# EAGLE board DeMux3 (EAGLE 6.6.0), part 1 of 2
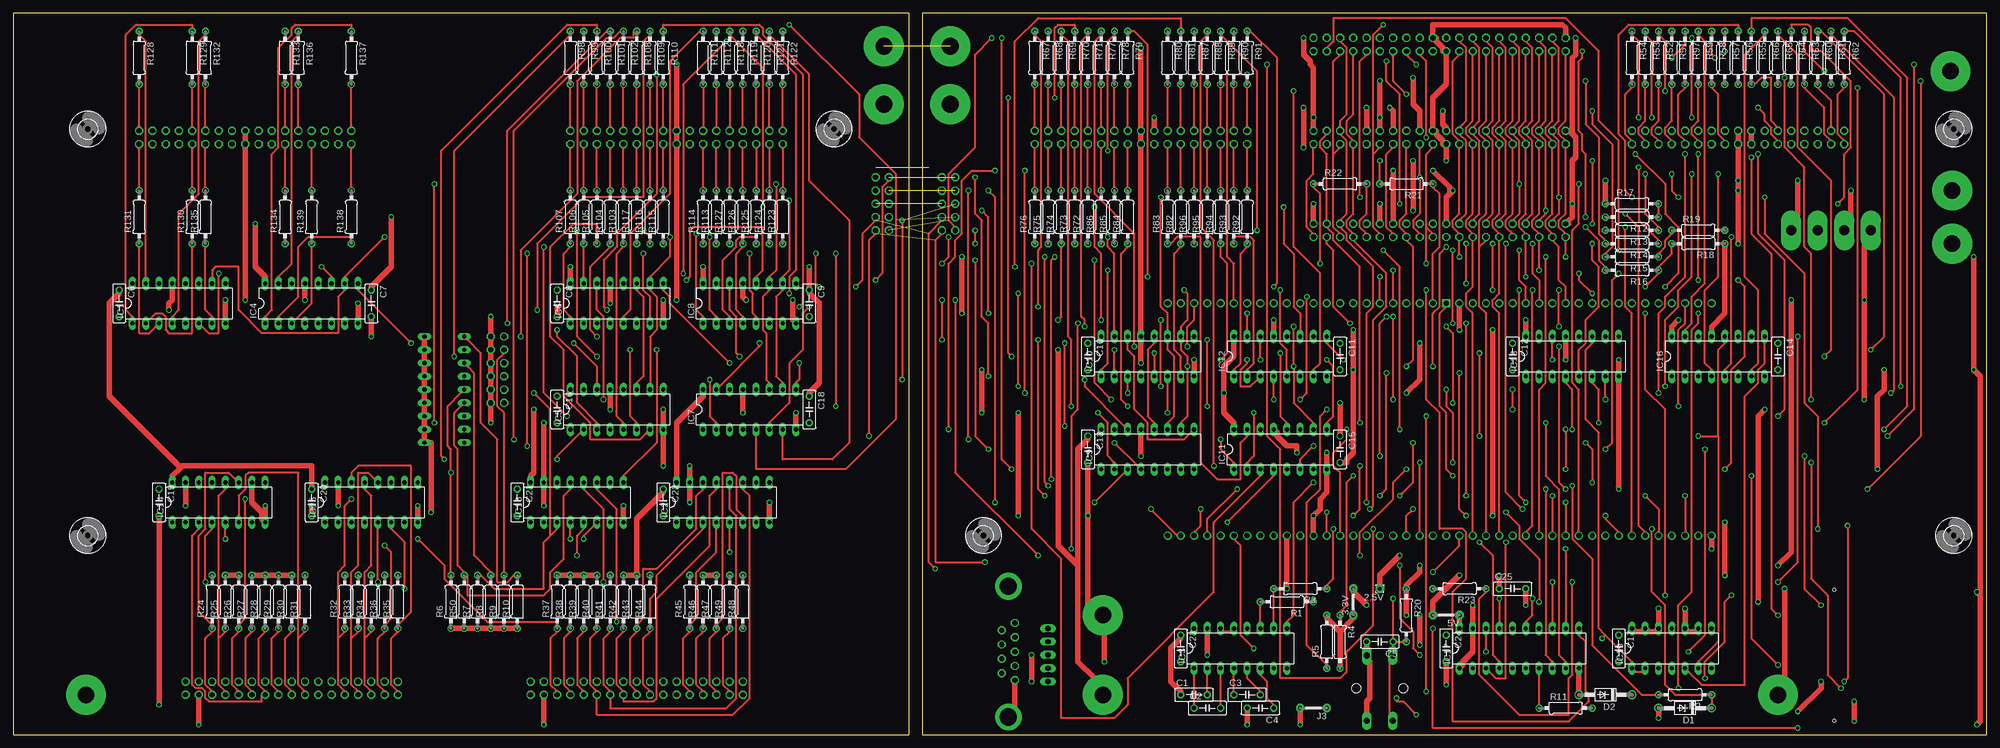
[diagram p3: board, top side]
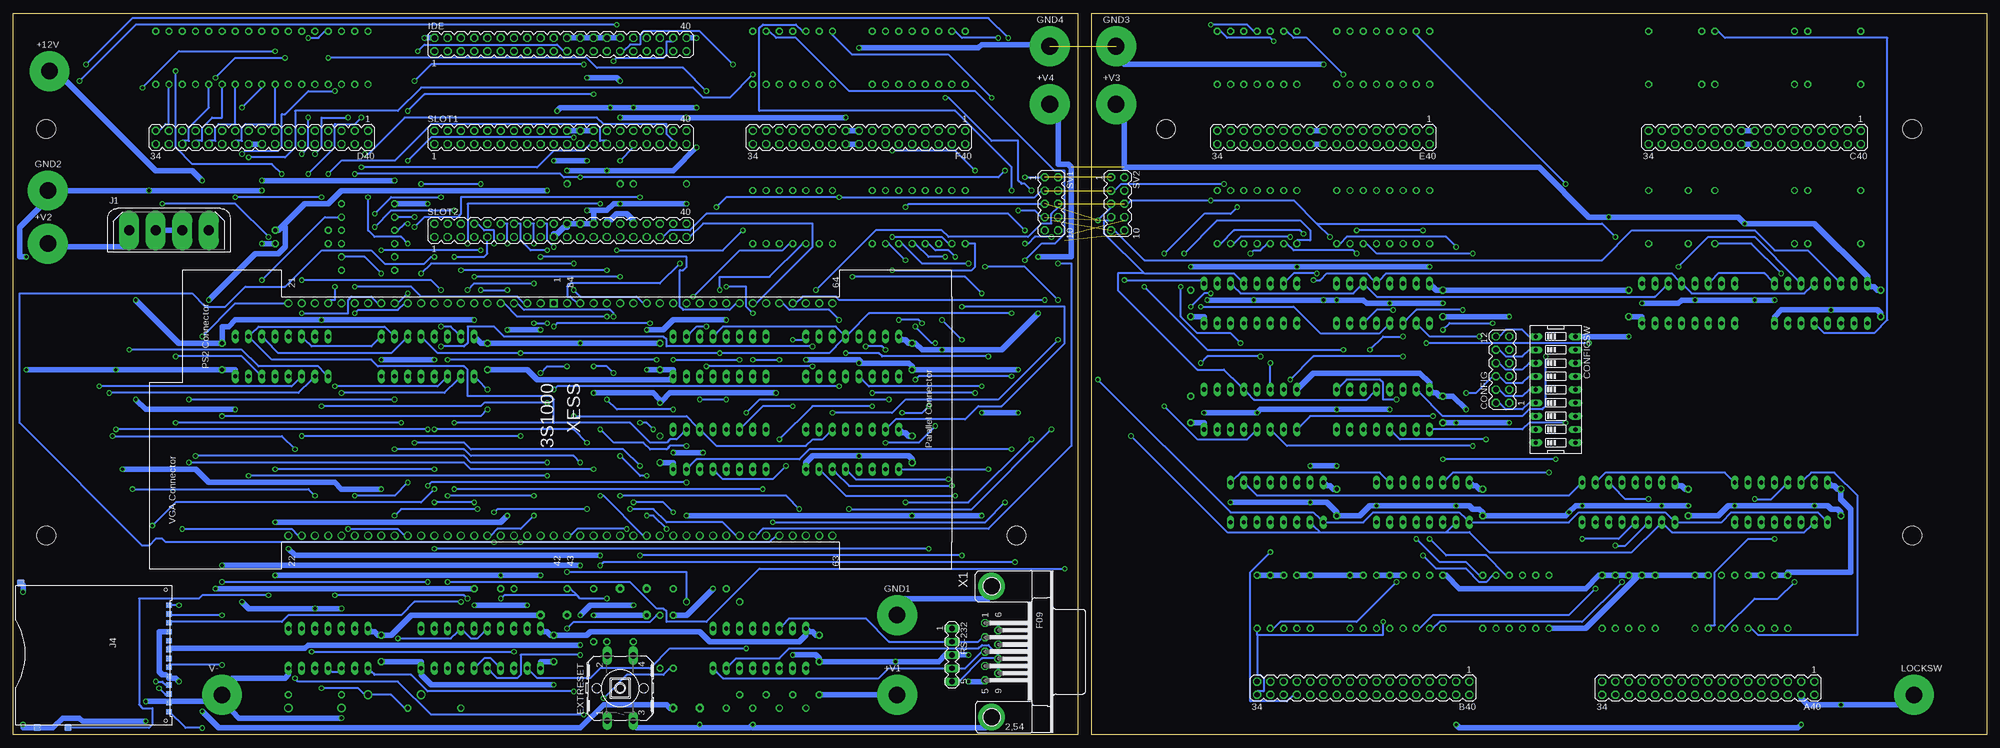
[diagram p4: board, bottom side, seen from below]

Size 377.82 x 138.11 mm. Coordinates in mm from the lower left corner, seen from the top.
Outline: 377.82,138.11 377.82,0 173.99,0 173.99,138.11
Outline: 377.82,138.11 173.99,138.11
Outline: 377.82,138.11 173.99,138.11
Outline: 171.45,138.11 0,138.11 0,0 171.45,0 171.45,138.11
Copper layers (1*16): Top 0.035mm / dielectric 1.5mm / Bottom 0.035mm
Design rules "15mils": minimum track width 15mil, minimum drill 24mil, track to track 15mil, track to pad 10mil, pad to pad 10mil, via to via 10mil, smd to smd 10mil, copper to edge 25mil, drill to drill 10mil, minimum pad ring 10mil, minimum via ring 8mil, stop-mask expansion 0mil, vias tented up to drill 0mil, thermal gap 10mil
Net classes: 1 supply: width 1.016 mm

## Footprints (pad centres in the part's own frame; a part is rotated, then mirrored left to right if it is on the bottom)
1,6/0,8 = drill 0.813 pad 1.6 octagon: 1 0,0
05 = drill 0.813 pad 1.6 octagon: 1 -2.54,0; 2 2.54,0
SPADELUG = drill 3.175 pad 7.62: 1 0,0
MA17-2 = drill 1.016 octagon: 1 -20.32,-1.27; 2 -20.32,1.27; 3 -17.78,-1.27; 4 -17.78,1.27; 5 -15.24,-1.27; 6 -15.24,1.27; 7 -12.7,-1.27; 8 -12.7,1.27; 9 -10.16,-1.27; 10 -10.16,1.27; 11 -7.62,-1.27; 12 -7.62,1.27; 13 -5.08,-1.27; 14 -5.08,1.27; 15 -2.54,-1.27; 16 -2.54,1.27; 17 0,-1.27; 18 0,1.27; 19 2.54,-1.27; 20 2.54,1.27; 21 5.08,-1.27; 22 5.08,1.27; 23 7.62,-1.27; 24 7.62,1.27; 25 10.16,-1.27; 26 10.16,1.27; 27 12.7,-1.27; 28 12.7,1.27; 29 15.24,-1.27; 30 15.24,1.27; 31 17.78,-1.27; 32 17.78,1.27; 33 20.32,-1.27; 34 20.32,1.27
C050-025X075 = drill 0.813 octagon: 1 -2.54,0; 2 2.54,0
MA06-2 = drill 1.016 octagon: 1 -6.35,-1.27; 2 -6.35,1.27; 3 -3.81,-1.27; 4 -3.81,1.27; 5 -1.27,-1.27; 6 -1.27,1.27; 7 1.27,-1.27; 8 1.27,1.27; 9 3.81,-1.27; 10 3.81,1.27; 11 6.35,-1.27; 12 6.35,1.27
EDG-09 = drill 0.813 long: 1 -10.16,-3.81; 2 -7.62,-3.81; 3 -5.08,-3.81; 4 -2.54,-3.81; 5 0,-3.81; 6 2.54,-3.81; 7 5.08,-3.81; 8 7.62,-3.81; 9 10.16,-3.81; 10 10.16,3.81; 11 7.62,3.81; 12 5.08,3.81; 13 2.54,3.81; 14 0,3.81; 15 -2.54,3.81; 16 -5.08,3.81; 17 -7.62,3.81; 18 -10.16,3.81
DO41Z10 = drill 1.118: A 5.08,0; C -5.08,0
B3F-40XX = drill 1.194 long: 1 -6.248,2.489; 2 6.248,2.489; 3 -6.248,-2.489; 4 6.248,-2.489 | hole 1.803: 0,-4.496; 0,4.496
DIL16 = drill 0.813 long: 1 -8.89,-3.81; 2 -6.35,-3.81; 3 -3.81,-3.81; 4 -1.27,-3.81; 5 1.27,-3.81; 6 3.81,-3.81; 7 6.35,-3.81; 8 8.89,-3.81; 9 8.89,3.81; 10 6.35,3.81; 11 3.81,3.81; 12 1.27,3.81; 13 -1.27,3.81; 14 -3.81,3.81; 15 -6.35,3.81; 16 -8.89,3.81
DIL20 = drill 0.813 long: 1 -11.43,-3.81; 2 -8.89,-3.81; 3 -6.35,-3.81; 4 -3.81,-3.81; 5 -1.27,-3.81; 6 1.27,-3.81; 7 3.81,-3.81; 8 6.35,-3.81; 9 8.89,-3.81; 10 11.43,-3.81; 11 11.43,3.81; 12 8.89,3.81; 13 6.35,3.81; 14 3.81,3.81; 15 1.27,3.81; 16 -1.27,3.81; 17 -3.81,3.81; 18 -6.35,3.81; 19 -8.89,3.81; 20 -11.43,3.81
DIL14 = drill 0.813 long: 1 -7.62,-3.81; 2 -5.08,-3.81; 3 -2.54,-3.81; 4 0,-3.81; 5 2.54,-3.81; 6 5.08,-3.81; 7 7.62,-3.81; 8 7.62,3.81; 9 5.08,3.81; 10 2.54,3.81; 11 0,3.81; 12 -2.54,3.81; 13 -5.08,3.81; 14 -7.62,3.81
MA20-2 = drill 1.016 octagon: 1 -24.13,-1.27; 2 -24.13,1.27; 3 -21.59,-1.27; 4 -21.59,1.27; 5 -19.05,-1.27; 6 -19.05,1.27; 7 -16.51,-1.27; 8 -16.51,1.27; 9 -13.97,-1.27; 10 -13.97,1.27; 11 -11.43,-1.27; 12 -11.43,1.27; 13 -8.89,-1.27; 14 -8.89,1.27; 15 -6.35,-1.27; 16 -6.35,1.27; 17 -3.81,-1.27; 18 -3.81,1.27; 19 -1.27,-1.27; 20 -1.27,1.27; 21 1.27,-1.27; 22 1.27,1.27; 23 3.81,-1.27; 24 3.81,1.27; 25 6.35,-1.27; 26 6.35,1.27; 27 8.89,-1.27; 28 8.89,1.27; 29 11.43,-1.27; 30 11.43,1.27; 31 13.97,-1.27; 32 13.97,1.27; 33 16.51,-1.27; 34 16.51,1.27; 35 19.05,-1.27; 36 19.05,1.27; 37 21.59,-1.27; 38 21.59,1.27; 39 24.13,-1.27; 40 24.13,1.27
FLOPPY-4 = drill 1.93 pad 3.81 long: 1 7.62,0; 2 2.54,0; 3 -2.54,0; 4 -7.62,0
SCDA5A = smd 1 x 1.3: 1 -7.525,-0.65; 2 -5.825,-0.65; 3 -4.125,-0.65; 3A -2.425,-0.65; 4 -0.725,-0.65; 4A 0.975,-0.65; 5 2.675,-0.65; 6 4.375,-0.65; 7 6.075,-0.65; 8 7.775,-0.65; 9 -9.225,-0.65; 10 11.175,-0.65; 11 9.475,-0.65 | smd 1.4 x 1.4: 12 14.2,-19.955; 13 14.2,-25.875; 14 -13.475,-28.975 | hole 0.61: 12.875,-1.235; -12.125,-1.235
0207/10 = drill 0.813 octagon: 1 -5.08,0; 2 5.08,0
MA05-1 = drill 1.016 long: 1 -5.08,0; 2 -2.54,0; 3 0,0; 4 2.54,0; 5 5.08,0
MA05-2 = drill 1.016 octagon: 1 -5.08,-1.27; 2 -5.08,1.27; 3 -2.54,-1.27; 4 -2.54,1.27; 5 0,-1.27; 6 0,1.27; 7 2.54,-1.27; 8 2.54,1.27; 9 5.08,-1.27; 10 5.08,1.27
3,6 = hole 3.6: 0,0
F09HP = drill 1.016 octagon: 1 -5.486,-1.27; 2 -2.743,-1.27; 3 0,-1.27; 4 2.743,-1.27; 5 5.486,-1.27; 6 -4.115,1.27; 7 -1.372,1.27; 8 1.372,1.27; 9 4.115,1.27 | drill 3.302 pad 5.08: G1 -12.522,0; G2 12.522,0
3S1000 = drill 1.016 square: 1 0,0 | drill 1.016: 2 0,-2.54; 3 0,-5.08; 4 0,-7.62; 5 0,-10.16; 6 0,-12.7; 7 0,-15.24; 8 0,-17.78; 9 0,-20.32; 10 0,-22.86; 11 0,-25.4; 12 0,-27.94; 13 0,-30.48; 14 0,-33.02; 15 0,-35.56; 16 0,-38.1; 17 0,-40.64; 18 0,-43.18; 19 0,-45.72; 20 0,-48.26; 21 0,-50.8; 22 44.45,-50.8; 23 44.45,-48.26; 24 44.45,-45.72; 25 44.45,-43.18; 26 44.45,-40.64; 27 44.45,-38.1; 28 44.45,-35.56; 29 44.45,-33.02; 30 44.45,-30.48; 31 44.45,-27.94; 32 44.45,-25.4; 33 44.45,-22.86; 34 44.45,-20.32; 35 44.45,-17.78; 36 44.45,-15.24; 37 44.45,-12.7; 38 44.45,-10.16; 39 44.45,-7.62; 40 44.45,-5.08; 41 44.45,-2.54; 42 44.45,0; 43 44.45,2.54; 44 44.45,5.08; 45 44.45,7.62; 46 44.45,10.16; 47 44.45,12.7; 48 44.45,15.24; 49 44.45,17.78; 50 44.45,20.32; 51 44.45,22.86; 52 44.45,25.4; 53 44.45,27.94; 54 44.45,30.48; 55 44.45,33.02; 56 44.45,35.56; 57 44.45,38.1; 58 44.45,40.64; 59 44.45,43.18; 60 44.45,45.72; 61 44.45,48.26; 62 44.45,50.8; 63 44.45,53.34; 64 0,53.34; 65 0,50.8; 66 0,48.26; 67 0,45.72; 68 0,43.18; 69 0,40.64; 70 0,38.1; 71 0,35.56; 72 0,33.02; 73 0,30.48; 74 0,27.94; 75 0,25.4; 76 0,22.86; 77 0,20.32; 78 0,17.78; 79 0,15.24; 80 0,12.7; 81 0,10.16; 82 0,7.62; 83 0,5.08; 84 0,2.54

## Placement (x,y rotation side)
2.5V  [1,6/0,8]  261.62,27.94 180 top
3.3V  J5MM  [05]  256.54,25.4 90 top
5V  J5MM  [05]  274.32,22.86 180 top
+12V  LUG  [SPADELUG]  370.84,127 0 bottom
+V1  LUG  [SPADELUG]  208.6,7.62 0 bottom
+V2  LUG  [SPADELUG]  371.16,93.98 0 bottom
+V3  LUG  [SPADELUG]  166.69,120.65 0 bottom
+V4  LUG  [SPADELUG]  179.39,120.65 0 bottom
A40  [MA17-2]  53.34,8.89 180 bottom
B40  [MA17-2]  119.38,8.89 180 bottom
C1  0.1uf  [C050-025X075]  226.06,7.62 0 top
C2  0.1uf  [C050-025X075]  228.6,5.08 0 top
C3  0.1uf  [C050-025X075]  236.22,7.62 0 top
C4  0.1uf  [C050-025X075]  238.76,5.08 180 top
C5  0.1uf  [C050-025X075]  261.62,17.78 180 top
C6  0.1uf  [C050-025X075]  20.32,82.55 270 top
C7  0.1uf  [C050-025X075]  68.58,82.55 270 top
C8  0.1uf  [C050-025X075]  104.14,82.55 270 top
C9  0.1uf  [C050-025X075]  152.4,82.55 270 top
C10  0.1uf  [C050-025X075]  205.74,72.39 270 top
C11  0.1uf  [C050-025X075]  254,72.39 270 top
C12  0.1uf  [C050-025X075]  287.02,72.39 270 top
C13  0.1uf  [C050-025X075]  205.74,54.61 270 top
C14  0.1uf  [C050-025X075]  337.82,72.39 270 top
C15  0.1uf  [C050-025X075]  254,54.61 270 top
C16  0.1uf  [C050-025X075]  104.14,62.23 270 top
C17  0.1uf  [C050-025X075]  307.34,16.51 270 top
C18  0.1uf  [C050-025X075]  152.4,62.23 270 top
C19  0.1uf  [C050-025X075]  27.94,44.45 270 top
C20  0.1uf  [C050-025X075]  57.15,44.45 270 top
C21  0.1uf  [C050-025X075]  96.52,44.45 270 top
C22  0.1uf  [C050-025X075]  124.46,44.45 270 top
C23  0.1uf  [C050-025X075]  223.52,16.51 270 top
C24  0.1uf  [C050-025X075]  274.32,16.51 270 top
C25  0.1uf  [C050-025X075]  287.02,27.94 0 top
C40  [MA17-2]  44.45,114.3 180 bottom
CONFIG  [MA06-2]  92.71,69.85 90 bottom
CONFIGSW  [EDG-09]  82.55,66.04 270 bottom
D1  1N4728  [DO41Z10]  320.04,5.08 180 top
D2  1N4728  [DO41Z10]  304.8,7.62 180 top
D40  [MA17-2]  330.2,114.3 180 bottom
E40  [MA17-2]  127,114.3 180 bottom
EXTRESET  [B3F-40XX]  261.62,8.89 90 bottom
F40  [MA17-2]  215.9,114.3 180 bottom
GND1  LUG  [SPADELUG]  208.6,22.86 0 bottom
GND2  LUG  [SPADELUG]  371.16,104.14 0 bottom
GND3  LUG  [SPADELUG]  166.69,131.76 0 bottom
GND4  LUG  [SPADELUG]  179.39,131.76 0 bottom
IC1  74HC595N  [DIL16]  31.75,82.55 0 top
IC2  74HC165N  [DIL16]  135.89,44.45 0 top
IC3  MAX232A  [DIL16]  234.95,16.51 0 top
IC4  74HC595N  [DIL16]  57.15,82.55 0 top
IC5  74HC595N  [DIL16]  115.57,62.23 0 top
IC6  74HC595N  [DIL16]  115.57,82.55 0 top
IC7  74HC595N  [DIL16]  140.97,62.23 0 top
IC8  74HC595N  [DIL16]  140.97,82.55 0 top
IC9  74HC595N  [DIL16]  217.17,54.61 0 top
IC10  74HC595N  [DIL16]  217.17,72.39 0 top
IC11  74HC595N  [DIL16]  242.57,54.61 0 top
IC12  74HC595N  [DIL16]  242.57,72.39 0 top
IC13  74HC595N  [DIL16]  298.45,72.39 0 top
IC14  74HC165N  [DIL16]  39.37,44.45 0 top
IC15  74HC165N  [DIL16]  68.58,44.45 0 top
IC16  74HC595N  [DIL16]  326.39,72.39 0 top
IC17  74LS244N  [DIL20]  288.29,16.51 0 top
IC18  74HC165N  [DIL16]  107.95,44.45 0 top
IC19  74ALS00N  [DIL14]  317.5,16.51 0 top
IDE  [MA20-2]  273.05,132.08 0 bottom
J1  [FLOPPY-4]  347.98,96.52 0 bottom
J3  J5MM  [05]  248.92,5.08 180 top
J4  SDCARD  [SCDA5A]  347.35,15.56 270 bottom
LOCKSW  LUG  [SPADELUG]  13.97,7.62 0 bottom
R1  330  [0207/10]  243.84,25.4 180 top
R2  330  [0207/10]  320.04,7.62 180 top
R3  330  [0207/10]  246.38,27.94 180 top
R4  330  [0207/10]  254,17.78 270 top
R5  330  [0207/10]  251.46,17.78 90 top
R6  3K  [0207/10]  83.82,25.4 90 top
R7  3K  [0207/10]  88.9,25.4 90 top
R8  3K  [0207/10]  91.44,25.4 90 top
R9  3K  [0207/10]  93.98,25.4 90 top
R10  3K  [0207/10]  96.52,25.4 90 top
R11  330  [0207/10]  297.18,5.08 0 top
R12  330  [0207/10]  309.88,99.06 180 top
R13  47  [0207/10]  309.88,96.52 180 top
R14  47  [0207/10]  309.88,93.98 180 top
R15  330  [0207/10]  309.88,91.44 180 top
R16  330  [0207/10]  309.88,88.9 180 top
R17  10K  [0207/10]  309.88,101.6 0 top
R18  10K  [0207/10]  322.58,93.98 180 top
R19  10K  [0207/10]  322.58,96.52 0 top
R20  4.7K  [0207/10]  266.7,22.86 270 top
R21  330  [0207/10]  266.7,105.41 180 top
R22  330  [0207/10]  254,105.41 0 top
R23  330  [0207/10]  276.86,27.94 180 top
R24  3K  [0207/10]  38.1,25.4 90 top
R25  3K  [0207/10]  40.64,25.4 90 top
R26  3K  [0207/10]  43.18,25.4 90 top
R27  3K  [0207/10]  45.72,25.4 90 top
R28  3K  [0207/10]  48.26,25.4 90 top
R29  3K  [0207/10]  50.8,25.4 90 top
R30  3K  [0207/10]  53.34,25.4 90 top
R31  3K  [0207/10]  55.88,25.4 90 top
R32  3K  [0207/10]  63.5,25.4 90 top
R33  3K  [0207/10]  66.04,25.4 90 top
R34  3K  [0207/10]  68.58,25.4 90 top
R35  3K  [0207/10]  73.66,25.4 90 top
R36  3K  [0207/10]  71.12,25.4 90 top
R37  3K  [0207/10]  104.14,25.4 90 top
R38  3K  [0207/10]  106.68,25.4 90 top
R39  3K  [0207/10]  109.22,25.4 90 top
R40  3K  [0207/10]  111.76,25.4 90 top
R41  3K  [0207/10]  114.3,25.4 90 top
R42  3K  [0207/10]  116.84,25.4 90 top
R43  3K  [0207/10]  119.38,25.4 90 top
R44  3K  [0207/10]  121.92,25.4 90 top
R45  3K  [0207/10]  129.54,25.4 90 top
R46  3K  [0207/10]  132.08,25.4 90 top
R47  3K  [0207/10]  134.62,25.4 90 top
R48  3K  [0207/10]  139.7,25.4 90 top
R49  3K  [0207/10]  137.16,25.4 90 top
R50  3K  [0207/10]  86.36,25.4 90 top
R51  [0207/10]  317.5,129.54 270 top
R52  [0207/10]  314.96,129.54 270 top
R53  [0207/10]  312.42,129.54 270 top
R54  [0207/10]  309.88,129.54 270 top
R55  [0207/10]  332.74,129.54 270 top
R56  [0207/10]  330.2,129.54 270 top
R57  [0207/10]  327.66,129.54 270 top
R58  3K  [0207/10]  325.12,129.54 270 top
R59  [0207/10]  322.58,129.54 270 top
R60  [0207/10]  345.44,129.54 270 top
R61  [0207/10]  347.98,129.54 270 top
R62  [0207/10]  350.52,129.54 270 top
R63  [0207/10]  342.9,129.54 270 top
R64  [0207/10]  340.36,129.54 270 top
R65  [0207/10]  337.82,129.54 270 top
R66  3K  [0207/10]  335.28,129.54 270 top
R67  [0207/10]  195.58,129.54 270 top
R68  [0207/10]  198.12,129.54 270 top
R69  [0207/10]  200.66,129.54 270 top
R70  [0207/10]  203.2,129.54 270 top
R71  [0207/10]  205.74,129.54 270 top
R72  [0207/10]  205.74,99.06 90 top
R73  [0207/10]  203.2,99.06 90 top
R74  3K  [0207/10]  200.66,99.06 90 top
R75  [0207/10]  198.12,99.06 90 top
R76  [0207/10]  195.58,99.06 90 top
R77  [0207/10]  208.28,129.54 270 top
R78  [0207/10]  210.82,129.54 270 top
R79  [0207/10]  213.36,129.54 270 top
R80  [0207/10]  220.98,129.54 270 top
R81  [0207/10]  223.52,129.54 270 top
R82  3K  [0207/10]  223.52,99.06 90 top
R83  [0207/10]  220.98,99.06 90 top
R84  [0207/10]  213.36,99.06 90 top
R85  [0207/10]  210.82,99.06 90 top
R86  [0207/10]  208.28,99.06 90 top
R87  [0207/10]  226.06,129.54 270 top
R88  [0207/10]  228.6,129.54 270 top
R89  [0207/10]  231.14,129.54 270 top
R90  3K  [0207/10]  233.68,129.54 270 top
R91  [0207/10]  236.22,129.54 270 top
R92  [0207/10]  236.22,99.06 90 top
R93  [0207/10]  233.68,99.06 90 top
R94  [0207/10]  231.14,99.06 90 top
R95  [0207/10]  228.6,99.06 90 top
R96  [0207/10]  226.06,99.06 90 top
R97  3K  [0207/10]  320.04,129.54 270 top
R98  [0207/10]  106.68,129.54 270 top
R99  [0207/10]  109.22,129.54 270 top
R100  [0207/10]  111.76,129.54 270 top
R101  [0207/10]  114.3,129.54 270 top
R102  [0207/10]  116.84,129.54 270 top
R103  [0207/10]  116.84,99.06 90 top
R104  [0207/10]  114.3,99.06 90 top
R105  3K  [0207/10]  111.76,99.06 90 top
R106  [0207/10]  109.22,99.06 90 top
R107  [0207/10]  106.68,99.06 90 top
R108  [0207/10]  119.38,129.54 270 top
R109  [0207/10]  121.92,129.54 270 top
R110  [0207/10]  124.46,129.54 270 top
R111  [0207/10]  132.08,129.54 270 top
R112  [0207/10]  134.62,129.54 270 top
R113  3K  [0207/10]  134.62,99.06 90 top
R114  [0207/10]  132.08,99.06 90 top
R115  [0207/10]  124.46,99.06 90 top
R116  [0207/10]  121.92,99.06 90 top
R117  [0207/10]  119.38,99.06 90 top
R118  [0207/10]  137.16,129.54 270 top
R119  [0207/10]  139.7,129.54 270 top
R120  [0207/10]  142.24,129.54 270 top
R121  3K  [0207/10]  144.78,129.54 270 top
R122  [0207/10]  147.32,129.54 270 top
R123  [0207/10]  147.32,99.06 90 top
R124  [0207/10]  144.78,99.06 90 top
R125  [0207/10]  142.24,99.06 90 top
R126  [0207/10]  139.7,99.06 90 top
R127  3K  [0207/10]  137.16,99.06 90 top
R128  [0207/10]  24.13,129.54 270 top
R129  [0207/10]  34.29,129.54 270 top
R130  [0207/10]  34.29,99.06 90 top
R131  [0207/10]  24.13,99.06 90 top
R132  [0207/10]  36.83,129.54 270 top
R133  [0207/10]  52.07,129.54 270 top
R134  [0207/10]  52.07,99.06 90 top
R135  3K  [0207/10]  36.83,99.06 90 top
R136  [0207/10]  54.61,129.54 270 top
R137  [0207/10]  64.77,129.54 270 top
R138  [0207/10]  64.77,99.06 90 top
R139  3K  [0207/10]  57.15,99.06 90 top
RS-232  [MA05-1]  198.12,15.24 270 bottom
SLOT1  [MA20-2]  273.05,114.3 0 bottom
SLOT2  [MA20-2]  273.05,96.52 0 bottom
SV1  [MA05-2]  179.07,101.6 270 bottom
SV2  [MA05-2]  166.37,101.6 270 bottom
U$5  [3,6]  371.48,115.89 0 top
U$6  [3,6]  371.48,38.1 0 top
U$7  [3,6]  185.74,38.1 0 top
U$8  [3,6]  14.29,38.1 0 top
U$9  [3,6]  14.29,115.89 0 top
U$11  [3,6]  157.16,115.89 0 top
V-  LUG  [SPADELUG]  337.82,7.62 0 bottom
X1  [F09HP]  190.5,15.88 270 bottom
XESS  3S1000  [3S1000]  274.32,82.55 270 bottom

## Tracks (layer width: path | path; a pad name or v marks a point on that pad's centre or on a via)
3S-LCLK  (via drill 0.61)
  Top 0.381: v280.67,36.83 283.21,34.29 283.21,15.24 284.48,13.97 IC17.4
  Bottom 0.381: IC17.4 285.12,13.34 286.38,14.61 287.65,14.61 288.93,13.34 IC17.6 | v280.67,36.83 233.04,36.83 231.78,38.1 XESS.59
3S-LSER  (via drill 0.61)
  Top 0.381: v237.49,16.51 234.95,19.05 234.95,36.2 233.68,37.47 XESS.58
  Bottom 0.381: v237.49,16.51 252.09,16.51 255.91,12.7 265.43,12.7 267.33,10.79 277.5,10.79 278.76,12.06 IC17.2
3S-SCLK  (via drill 0.61)
  Top 0.381: v290.83,26.04 290.83,22.86 289.56,21.59 IC17.15 | v316.23,26.67 316.23,62.23 312.42,66.04 v312.42,80.64
  Bottom 0.381: v290.83,26.04 291.46,26.67 v316.23,26.67 | v312.42,80.64 311.79,81.28 304.17,81.28 302.89,82.55 XESS.12
3S-SSER  (via drill 0.61)
  Top 0.381: v322.58,80.64 322.58,78.74 321.31,77.47 321.31,27.3 318.77,24.77 v318.77,8.89
  Bottom 0.381: R11.2 302.89,5.08 305.44,7.62 309.25,7.62 D2.C 310.51,7.62 311.79,8.89 v318.77,8.89 | v322.58,80.64 313.69,80.64 313.69,83.19 313.06,83.82 309.25,83.82 307.98,82.55 XESS.14
!3S-LCL  (via drill 0.61)
  Top 0.381: v270.51,85.09 270.51,64.14 273.05,61.59 273.05,39.37 277.5,39.37 278.13,38.73 278.13,29.84 275.59,27.3 275.59,2.54 297.81,2.54 301.62,6.35 301.62,7.62 300.99,8.26 300.99,17.78 299.72,19.05 IC17.11
  Bottom 0.381: v270.51,85.09 269.24,83.82 258.44,83.82 257.18,82.55 XESS.78
!3S-SCL  (via drill 0.61)
  Top 0.381: v293.37,46.99 293.37,15.24 294.64,13.97 IC17.8 | v234.31,46.99 228.6,41.27 228.6,38.73 XESS.60
  Bottom 0.381: v234.31,46.99 v293.37,46.99
!LCL  (via drill 0.61)  (1 unrouted)
  Top 0.381: IC9.10 223.52,59.69 224.79,60.96 v224.79,70.48 224.79,72.39 223.52,73.66 223.52,74.93 IC10.10 223.52,77.47 223.52,78.11 224.79,79.38 224.79,84.45 v224.16,85.09 | v245.11,78.11 v245.11,70.48 245.11,63.5 248.92,59.69 IC11.10 | v293.37,59.69 293.37,49.53 295.91,46.99 295.91,15.24 297.18,13.97 IC17.9 | IC1.10 38.1,87.63 38.1,88.9 38.73,89.53 43.18,89.53 43.18,81.28 47.62,76.83 62.23,76.83 62.23,83.82 63.5,85.09 IC4.10 63.5,87.63 v71.12,95.25 | IC5.10 121.92,67.31 121.92,76.2 123.19,77.47 123.19,83.82 121.92,85.09 IC6.10 121.92,87.63 125.73,91.44 v125.73,95.25 | IC7.10 147.32,67.31 146.05,68.58 146.05,83.82 147.32,85.09 IC8.10 147.32,87.63 148.59,88.9 v148.59,102.23
  Bottom 0.381: v224.16,85.09 212.72,96.52 200.03,96.52 198.75,95.25 183.51,95.25 180.97,97.79 179.07,97.79 179.07,99.69 177.8,100.97 SV1.6 | IC13.10 305.44,76.83 306.7,78.11 330.83,78.11 332.11,76.83 IC16.10 332.11,75.56 328.3,71.75 309.25,71.75 307.98,70.48 291.46,70.48 290.83,69.85 290.83,64.77 274.95,64.77 274.32,64.14 274.32,59.69 | v245.11,78.11 247.01,78.11 248.28,76.83 IC12.10 | 274.32,59.69 259.71,59.69 255.91,55.88 252.73,55.88 252.09,56.52 250.82,56.52 249.56,57.78 IC11.10 | 274.32,59.69 v293.37,59.69 | v224.79,70.48 v245.11,70.48 | SV2.6 164.47,101.6 163.83,102.23 v148.59,102.23 132.72,102.23 128.27,97.79 | 128.27,97.79 v125.73,95.25 | v71.12,95.25 73.66,97.79 128.27,97.79
!SCL  (via drill 0.61)  (1 unrouted)
  Top 0.381: v297.18,35.56 297.18,21.59 IC17.12 | v202.56,35.56 202.56,60.96 203.84,62.23 v203.84,78.74 | v208.28,79.38 208.28,92.08 207.01,93.34 v207.01,100.97 | v170.18,98.42 v170.18,67.94
  Bottom 0.381: v202.56,35.56 v297.18,35.56 | v203.84,78.74 204.47,79.38 v208.28,79.38 | v207.01,100.97 206.38,101.6 180.97,101.6 SV1.5 | IC14.1 31.11,41.27 32.38,42.55 48.9,42.55 50.8,40.64 59.05,40.64 IC15.1 60.33,41.27 61.59,42.55 78.11,42.55 80.01,40.64 98.42,40.64 IC18.1 99.69,41.27 100.97,42.55 117.47,42.55 119.38,40.64 126.36,40.64 IC2.1 127.64,41.27 128.91,42.55 144.78,42.55 v170.18,67.94 | v170.18,98.42 167.64,100.97 SV2.5
!SSER  (via drill 0.61)  (1 unrouted)
  Top 0.381: v294.64,29.21 294.64,21.59 IC17.13 | v176.53,31.75 175.26,33.02 175.26,95.89 177.8,98.42 SV1.8 | v123.19,73.66 123.19,55.88 116.84,49.53 IC18.9 | v161.29,85.72 162.56,87 162.56,95.89 165.1,98.42 SV2.8
  Bottom 0.381: v294.64,29.21 259.71,29.21 254.63,24.13 253.37,24.13 252.73,23.5 252.73,21.59 245.11,21.59 234.95,31.75 v176.53,31.75 | v123.19,73.66 149.22,73.66 v161.29,85.72
+2V5  (via drill 0.61)
  Top 1.016: v325.12,35.56 325.12,37.47 XESS.22 | v265.43,34.29 261.62,30.48 261.62,28.57 2.5V.1
  Bottom 1.016: v325.12,35.56 323.85,34.29 v265.43,34.29
+3V3  (via drill 0.61)
  Top 1.016: v266.7,22.86 266.7,27.3 R20.1 266.7,28.57 269.24,31.11 v269.24,32.38 | 254,19.68 251.46,22.23 R5.2 | 254,19.68 254,13.34 R4.2 | v243.84,27.94 243.84,37.47 XESS.54 | 254,19.68 256.54,22.23 3.3V.1 | v259.08,120.02 259.08,116.2 SLOT1.32 | v263.52,120.02 264.16,119.38 264.16,116.2 SLOT1.28 | v273.69,119.38 273.69,116.84 274.32,116.2 SLOT1.20 | 275.27,103.82 274.32,102.87 274.32,98.42 SLOT2.20 | v275.59,104.14 275.27,103.82 | v264.16,107.95 264.16,98.42 SLOT2.28 | v271.78,107.95 274.95,104.78 274.95,104.14 275.27,103.82 | v247.01,112.39 v247.01,120.02 | v337.82,32.38 340.36,34.92 v340.36,83.19
  Bottom 1.016: v266.7,22.86 257.18,22.86 3.3V.1 | v243.84,27.94 248.92,22.86 250.82,22.86 R5.2 | v273.69,119.38 273.05,120.02 v263.52,120.02 v259.08,120.02 v247.01,120.02 | SLOT2.32 259.08,98.42 260.35,99.69 262.25,99.69 263.52,98.42 264.16,98.42 SLOT2.28 | 326.07,97.47 321.94,101.6 317.5,101.6 314.96,104.14 v275.59,104.14 | 326.07,97.47 327.02,96.52 R19.2 | v271.78,107.95 v264.16,107.95 251.46,107.95 v247.01,112.39 | v269.24,32.38 v337.82,32.38 | v340.36,83.19 331.47,92.08 327.02,92.08 325.75,93.34 325.75,97.16 326.07,97.47
+5V  (via drill 0.61)
  Top 1.016: v284.48,30.48 284.48,28.57 C25.1 | v276.86,30.48 271.78,25.4 271.78,23.5 5V.2 | v276.86,77.47 276.86,81.92 XESS.2 | v283.21,41.91 v283.21,77.47 | v327.66,30.48 v327.66,40.64
  Bottom 1.016: v276.86,30.48 v284.48,30.48 v327.66,30.48 | v283.21,77.47 v276.86,77.47 | v283.21,41.91 284.48,40.64 v327.66,40.64
+12V  (via drill 0.61)
  Top 1.016: v341.63,106.05 341.63,99.69 J1.1
  Bottom 1.016: v341.63,106.05 343.54,107.95 350.52,107.95 367.67,125.09 +12V.1
AC0
  Top 0.381: R101.2 114.3,123.83 114.3,116.2 E40.7
AC1
  Top 0.381: R106.2 109.22,104.78 109.22,112.39 E40.4
AC2
  Top 0.381: R111.2 132.08,123.83 132.08,116.2 E40.21
AC3
  Top 0.381: R116.2 121.92,104.78 121.92,112.39 E40.14
AC4
  Top 0.381: R121.2 144.78,123.83 144.78,116.2 E40.31
AC5
  Top 0.381: R126.2 139.7,104.78 139.7,112.39 E40.28
AC6
  Top 0.381: R70.2 203.2,123.83 203.2,116.2 F40.7
AC7
  Top 0.381: R75.2 198.12,104.78 198.12,112.39 F40.4
AC8
  Top 0.381: R80.2 220.98,123.83 220.98,116.2 F40.21
AC9
  Top 0.381: R85.2 210.82,104.78 210.82,112.39 F40.14
AC10
  Top 0.381: R90.2 233.68,123.83 233.68,116.2 F40.31
AC11
  Top 0.381: R95.2 228.6,104.78 228.6,112.39 F40.28
AND
  Top 0.381: R54.2 309.88,123.83 308.61,122.56 308.61,114.94 309.88,113.67 D40.2
BREAK
  Bottom 0.381: R57.2 327.66,123.83 327.66,116.84 333.38,116.84 334.01,116.2 334.01,113.67 335.28,113.67 D40.22
CA
  Top 0.381: R63.2 342.9,123.83 346.71,120.02 346.71,114.94 347.98,113.67 D40.32
CF1
  Top 0.381: CONFIGSW.6 85.72,62.87 84.45,61.59 84.45,55.24 85.09,54.61 85.09,32.38 86.36,31.11 R50.2 87,30.48 87,26.67 101.6,26.67 102.87,27.94 102.87,31.11 105.41,33.66 105.41,45.72 106.68,46.99 IC18.13
  Bottom 0.381: CONFIG.2 93.34,63.5 92.08,62.23 88.9,62.23 87.63,63.5 CONFIGSW.6
CF2  (via drill 0.61)
  Top 0.381: R6.2 83.82,31.11 v83.82,50.16 83.82,54.61 83.19,55.24 83.19,62.87 85.72,65.41 CONFIGSW.5
  Bottom 0.381: v83.82,50.16 102.23,50.16 103.5,48.9 IC18.14 | CONFIG.4 93.34,66.04 92.08,64.77 88.9,64.77 87.63,66.04 CONFIGSW.5
CF3  (via drill 0.61)
  Top 0.381: 102.87,38.1 104.14,39.37 IC18.3 | 102.87,38.1 101.6,36.83 101.6,27.94 92.08,27.94 89.53,30.48 R7.2 | v99.69,65.41 102.87,62.23 102.87,38.1
  Bottom 0.381: CONFIGSW.4 87.63,68.58 88.9,67.31 92.08,67.31 93.34,68.58 CONFIG.6 94.61,68.58 97.79,65.41 v99.69,65.41
CF4  (via drill 0.61)
  Top 0.381: R8.2 91.44,31.11 88.27,34.29 88.27,69.22 87,70.48 CONFIGSW.3 | v106.68,37.47 106.68,39.37 IC18.4
  Bottom 0.381: v106.68,37.47 103.5,34.29 95.89,34.29 92.08,30.48 R8.2 | CONFIG.8 93.34,71.12 92.08,69.85 88.9,69.85 87.63,71.12 CONFIGSW.3
CF5  (via drill 0.61)
  Top 0.381: R9.2 93.98,31.11 93.98,61.59 92.71,62.87 92.71,71.75 93.98,73.03 CONFIG.10 | v107.95,34.29 107.95,38.1 109.22,39.37 IC18.5
  Bottom 0.381: v107.95,34.29 105.41,31.75 99.69,31.75 97.16,29.21 95.89,29.21 94.61,30.48 R9.2 | CONFIGSW.2 87.63,73.66 88.9,72.39 92.08,72.39 93.34,73.66 CONFIG.10
CF6  (via drill 0.61)
  Top 0.381: R10.2 95.89,30.48 94.61,29.21 92.71,29.21 92.71,56.52 89.53,59.69 89.53,73.03 87,75.56 CONFIGSW.1 | v109.22,37.47 109.22,38.1 111.12,40.01 IC18.6
  Bottom 0.381: v109.22,37.47 104.78,33.02 99.69,33.02 97.16,30.48 R10.2 | CONFIG.12 93.34,76.2 92.08,77.47 88.9,77.47 87.63,76.2 CONFIGSW.1
CLK  (via drill 0.61)
  Top 0.381: 270.51,97.16 271.78,95.89 SLOT2.21 | 270.51,97.16 270.51,111.12 271.78,112.39 SLOT1.21 | v302.26,84.45 299.72,87 v299.72,88.27 | v270.51,90.17 270.51,97.16
  Bottom 0.381: v302.26,84.45 304.17,82.55 XESS.13 | v299.72,88.27 297.81,90.17 v270.51,90.17
CONT  (via drill 0.61)
  Top 0.381: R46.1 132.08,19.68 130.81,18.41 130.81,9.53 132.08,8.26 B40.28 | v137.16,34.92 137.16,39.37 IC2.5
  Bottom 0.381: v137.16,34.92 140.97,31.11 140.97,6.35 133.99,6.35 132.72,7.62 B40.28
DCA
  Top 0.381: R51.2 317.5,123.83 317.5,117.47 316.23,116.2 316.23,114.94 317.5,113.67 D40.8
DEFER
  Bottom 0.381: R66.2 335.28,123.83 335.28,116.84 338.45,116.84 339.09,116.2 339.09,113.67 340.36,113.67 D40.26
DEP
  Top 0.381: B40.20 121.92,8.26 120.65,9.53 120.65,18.41 121.92,19.68 R44.1 121.92,20.95 121.92,26.04 123.19,27.3 123.19,30.48 132.08,39.37 IC2.3
DF0
  Top 0.381: R128.2 24.13,123.83 24.13,116.2 C40.1
DF1
  Top 0.381: R130.2 34.29,104.78 34.29,112.39 C40.10
DF2
  Top 0.381: R132.2 36.83,123.83 36.83,116.2 C40.11
EXAM
  Top 0.381: B40.26 129.54,8.26 128.27,9.53 128.27,18.41 129.54,19.68 R45.1 129.54,20.95 130.81,22.23 130.81,31.11 134.62,34.92 134.62,39.37 IC2.4
EXECUTE
  Bottom 0.381: R65.2 337.82,123.83 337.82,118.11 339.73,118.11 341.63,116.2 341.63,113.67 342.9,113.67 D40.28
FETCH  (via drill 0.61)
  Top 0.381: v334.01,120.02 335.28,118.75 335.28,117.47 336.55,116.2 336.55,114.94 337.82,113.67 D40.24
  Bottom 0.381: v334.01,120.02 330.2,123.83 R56.2
GND  (via drill 0.61)  (1 unrouted)
  Top 1.016: v351.79,104.14 351.79,99.69 J1.3 | SLOT2.2 297.81,97.79 297.81,98.42 298.45,99.06 v298.45,101.6 298.45,109.86 299.08,110.49 299.08,114.3 298.13,115.25 | 298.13,115.25 297.81,115.57 SLOT1.2 | v299.08,133.35 299.08,130.18 298.45,129.54 298.45,115.57 298.13,115.25 | D40.17 330.2,114.94 330.2,113.67 D40.18 330.2,112.39 v330.2,106.05 v330.2,104.14 v330.2,93.98 | D40.19 332.74,114.94 332.74,113.67 D40.20 | IC16.13 325.12,77.47 325.12,78.11 327.66,80.64 327.66,93.34 R18.1 | v304.8,106.05 304.8,102.23 R17.1 | IC17.10 299.72,11.43 299.72,8.26 D2.A | v279.4,24.77 279.4,21.59 IC17.19 279.4,19.05 279.4,15.88 277.5,13.97 277.5,13.34 IC17.1 | v289.56,24.77 289.56,27.3 C25.2 | v274.32,9.53 274.32,13.34 C24.2 | v307.34,71.75 307.34,69.85 IC13.8 307.34,67.31 v307.34,46.99 | v297.18,71.75 297.18,74.93 IC13.13 | v352.43,2.54 v352.43,6.35 | 376.24,26.99 376.56,26.67 376.56,2.54 v375.92,1.91 | 376.24,26.99 v375.92,27.3 | v314.96,3.17 314.96,4.45 D1.A | 376.24,26.99 376.56,27.3 376.56,68.58 v375.29,69.85 v375.29,91.44 | v356.87,50.8 356.87,64.77 358.14,66.04 v358.14,69.85 | v339.09,27.94 339.09,10.79 V-.1 | v248.92,101.6 248.92,98.42 SLOT2.40 | v261.62,101.6 261.62,98.42 SLOT2.30 | v274.32,109.86 274.32,112.39 SLOT1.19 273.69,113.03 273.69,113.67 272.42,114.94 272.42,115.57 SLOT1.22 271.78,116.2 271.78,121.92 274.32,124.46 274.32,130.18 IDE.19 273.69,130.81 273.69,131.44 272.42,132.72 272.42,133.35 IDE.22 271.78,133.99 271.78,135.89 296.55,135.89 297.18,135.25 297.18,133.99 IDE.2 | v267.97,109.86 v267.97,100.33 | SLOT1.40 248.92,116.2 v248.92,118.11 248.92,127.64 248.28,128.27 248.28,128.91 247.01,130.18 v247.01,133.35
  Top 1.016: SLOT1.30 261.62,116.2 v261.62,118.11 v261.62,125.09 | v215.9,71.12 215.9,74.93 IC10.13 215.9,77.47 215.9,112.39 F40.18 215.9,113.67 215.9,114.94 F40.17 215.9,116.2 v215.9,131.44 | v226.06,71.75 226.06,69.85 IC10.8 | v218.44,118.11 218.44,116.2 F40.19 | v267.97,125.73 267.97,120.65 269.24,119.38 269.24,116.2 SLOT1.24 | C5.2 259.08,17.14 259.08,16.51 EXTRESET.4 259.71,13.97 259.71,6.99 259.08,6.35 259.08,3.81 EXTRESET.3 | v236.22,1.91 236.22,4.45 C4.2 | v246.38,1.91 246.38,4.45 J3.2 | X1.5 191.77,10.16 191.77,5.08 X1.G2 | v228.6,15.24 228.6,19.05 IC3.15 | v194.94,15.24 v194.94,10.16 | v245.75,53.98 245.75,55.24 243.84,55.24 241.94,57.15 241.94,57.78 IC11.13 | v251.46,53.98 251.46,52.07 IC11.8 251.46,49.53 251.46,46.35 250.19,45.09 250.19,43.18 v248.92,41.91 248.92,38.73 XESS.52 | v241.3,79.38 241.3,77.47 IC12.13 | v256.54,77.47 v256.54,69.85 256.54,53.98 255.27,52.7 255.27,52.07 254.63,52.07 C15.2 | v215.9,53.34 215.9,57.15 IC9.13 | C13.2 205.74,51.44 v205.74,41.91 205.74,24.77 GND1.1 208.91,19.68 v208.91,13.97 | v185.42,69.85 v185.42,61.59 | v192.41,61.59 v192.41,41.91 | CONFIGSW.18 78.74,75.56 78.74,74.3 CONFIGSW.17 78.74,73.03 78.74,71.75 CONFIGSW.16 78.74,70.48 78.74,69.22 CONFIGSW.15 78.74,67.94 78.74,66.67 CONFIGSW.14 78.74,65.41 78.74,64.14 CONFIGSW.13 78.74,62.87 78.74,61.59 CONFIGSW.12 78.74,60.33 78.74,59.05 CONFIGSW.11 78.74,57.78 78.74,56.52 CONFIGSW.10 80.01,55.88 v80.01,42.55 | v68.58,76.2 68.58,79.38 C7.2 | C40.17 44.45,114.94 44.45,113.67 C40.18 44.45,112.39 v44.45,83.19 | v29.84,81.28 29.84,82.55 30.48,83.19 30.48,85.09 IC1.13
  Top 1.016: v55.88,83.19 55.88,85.09 IC4.13 | v40.64,83.19 40.64,80.01 IC1.8 | v66.04,82.55 66.04,80.01 IC4.8 | v101.6,1.91 101.6,6.99 B40.4 | v35.56,1.91 35.56,6.99 A40.4 | v33.02,43.81 33.02,46.99 IC14.15 | IC14.10 45.72,46.99 45.72,44.45 47.62,42.55 47.62,41.27 IC14.8 48.26,41.91 v48.26,43.81 | v62.23,43.81 62.23,46.99 IC15.15 | v57.15,43.81 57.15,42.55 C20.2 | v77.47,43.81 77.47,41.91 IC15.8 | v139.7,61.59 139.7,64.77 IC7.13 | v149.86,61.59 149.86,59.69 IC7.8 | v116.84,43.81 116.84,41.91 IC18.8 | v129.54,51.44 129.54,49.53 IC2.15 129.54,46.99 v129.54,44.45 | v124.46,51.44 124.46,57.15 IC5.8 124.46,59.69 v124.46,62.23 | v144.78,44.45 144.78,41.91 IC2.8 | v114.3,62.23 114.3,64.77 IC5.13 | v101.6,59.69 101.6,49.53 IC18.15 101.6,46.99 v101.6,43.81 | v91.44,80.01 91.44,76.83 CONFIG.11 91.44,75.56 91.44,74.3 CONFIG.9 91.44,73.03 91.44,71.75 CONFIG.7 91.44,70.48 91.44,69.22 CONFIG.5 91.44,67.94 91.44,66.67 CONFIG.3 91.44,65.41 91.44,64.14 CONFIG.1 91.44,62.87 v91.44,59.69 | v114.3,82.55 114.3,85.09 IC6.13 | v104.14,82.55 104.14,80.64 C8.2 | v124.46,83.19 124.46,80.01 IC6.8 | v140.34,83.19 139.7,83.82 139.7,85.09 IC8.13 | v149.22,83.19 149.22,79.38 IC8.8 | v127,83.19 127,112.39 E40.18 127,113.67 127,114.94 E40.17 127,116.2 v127,128.27 | v27.94,5.71 27.94,41.27 C19.2
  Bottom 1.016: J1.2 346.71,96.52 349.25,96.52 J1.3 | v298.45,101.6 304.17,101.6 R17.1 | v299.08,133.35 297.81,133.35 IDE.2 | D40.20 332.11,113.03 330.83,113.03 D40.18 | v330.2,93.98 328.3,93.98 R18.1 | v304.8,106.05 v330.2,106.05 | v330.2,104.14 v351.79,104.14 367.67,104.14 GND2.1 372.75,100.97 376.56,97.16 376.56,91.44 v375.29,91.44 | C17.2 306.7,13.97 299.72,13.97 IC17.10 299.72,11.43 297.81,9.53 v274.32,9.53 | C24.2 274.95,13.97 276.86,13.97 IC17.1 | v289.56,24.77 v279.4,24.77 | v307.34,71.75 v297.18,71.75 | IC16.8 335.28,69.85 337.19,69.85 C14.2 338.45,69.85 v358.14,69.85 v375.29,69.85 | V-.1 341,6.35 347.98,6.35 J4.11 348.62,6.35 v352.43,6.35 | v352.43,2.54 364.49,2.54 365.12,3.17 368.3,3.17 370.2,1.27 372.75,1.27 J4.13 373.38,1.27 375.92,1.27 v375.92,1.91 | v375.92,27.3 375.92,28.57 J4.14 | IC19.7 325.12,11.43 325.75,10.79 335.92,10.79 V-.1 | v314.96,3.17 334.64,3.17 335.92,4.45 V-.1 | v307.34,46.99 314.96,46.99 316.23,48.26 340.36,48.26 342.9,50.8 v356.87,50.8 | v339.09,27.94 290.19,27.94 C25.2 | IDE.30 262.25,133.35 263.52,133.35 IDE.28 264.8,133.35 266.06,133.35 IDE.26 267.33,133.35 268.61,133.35 IDE.24 269.88,133.35 271.14,133.35 IDE.22 | SLOT1.26 267.33,115.57 268.61,115.57 SLOT1.24 269.88,115.57 271.14,115.57 SLOT1.22 | SLOT2.19 274.32,95.89 273.69,95.89 272.42,97.16 271.78,97.16 SLOT2.22 271.14,97.79 269.88,97.79 SLOT2.24 268.61,97.79 267.33,97.79 SLOT2.26 266.7,98.42 266.7,100.33 | v248.92,101.6 v261.62,101.6 262.89,101.6 264.16,100.33 266.7,100.33 | v274.32,109.86 v267.97,109.86 | v267.97,100.33 266.7,100.33 | v261.62,118.11 v248.92,118.11 v218.44,118.11
  Bottom 1.016: v247.01,133.35 248.28,133.35 IDE.40 | F40.20 217.81,113.03 216.53,113.03 F40.18 | F40.19 217.81,115.57 216.53,115.57 F40.17 | 215.26,71.12 v215.9,71.12 | 215.26,71.12 206.38,71.12 205.74,70.48 C10.2 205.1,69.85 v185.42,69.85 | v226.06,71.75 215.9,71.75 215.26,71.12 | v215.9,131.44 193.04,131.44 192.41,132.08 182.88,132.08 GND4.1 | v267.97,125.73 262.25,125.73 v261.62,125.09 | 236.54,1.59 236.85,1.27 246.38,1.27 | 236.54,1.59 v236.22,1.91 | 246.38,1.27 258.44,1.27 EXTRESET.3 | 246.38,1.27 v246.38,1.91 | v228.6,15.24 224.16,15.24 223.52,14.61 C23.2 222.88,13.97 v208.91,13.97 200.66,13.97 199.39,15.24 RS-232.3 196.85,15.24 v194.94,15.24 | v194.94,10.16 192.41,10.16 X1.5 | 236.54,1.59 236.22,1.27 191.77,1.27 X1.G2 | IC11.8 251.46,52.07 253.37,52.07 C15.2 | v251.46,53.98 v245.75,53.98 | C12.2 286.38,69.85 279.4,69.85 277.5,67.94 252.09,67.94 IC12.8 251.46,69.85 253.37,69.85 C11.2 254.63,69.85 v256.54,69.85 | v241.3,79.38 251.46,79.38 253.37,77.47 v256.54,77.47 | C13.2 205.74,52.7 206.38,53.34 v215.9,53.34 224.79,53.34 226.06,52.07 IC9.8 | X1.G1 191.13,26.04 207.01,26.04 GND1.1 | v248.92,41.91 v205.74,41.91 v192.41,41.91 | v185.42,61.59 v192.41,61.59 | IC4.8 66.04,80.01 67.94,80.01 C7.2 | v68.58,76.2 77.47,76.2 CONFIGSW.18 | C40.18 45.09,113.03 46.35,113.03 C40.20 | C40.19 46.35,115.57 45.09,115.57 C40.17 | C6.2 20.32,80.64 20.95,81.28 v29.84,81.28 39.37,81.28 40.64,80.01 IC1.8 | v40.64,83.19 v44.45,83.19 v55.88,83.19 58.42,83.19 59.05,82.55 v66.04,82.55 | A40.4 35.56,6.99 34.29,5.71 v27.94,5.71 17.14,5.71 LOCKSW.1 | v101.6,1.91 100.97,1.27 36.2,1.27 v35.56,1.91 | C19.2 27.94,42.55 28.57,43.18 29.84,43.18 30.48,43.81 v33.02,43.81 v48.26,43.81 49.53,43.81 51.44,41.91 56.52,41.91 C20.2
  Bottom 1.016: v57.15,43.81 v62.23,43.81 v77.47,43.81 78.74,43.81 v80.01,42.55 80.64,41.91 95.89,41.91 C21.2 96.52,42.55 97.16,43.18 98.42,43.18 99.06,43.81 v101.6,43.81 v116.84,43.81 118.11,43.81 120.02,41.91 123.83,41.91 C22.2 124.46,42.55 126.36,44.45 v129.54,44.45 v144.78,44.45 | v149.86,61.59 v139.7,61.59 139.06,62.23 v124.46,62.23 v114.3,62.23 | C18.2 151.76,59.69 149.86,59.69 IC7.8 | v129.54,51.44 v124.46,51.44 | C16.2 103.5,59.69 v101.6,59.69 v91.44,59.69 | E40.18 127.64,113.03 128.91,113.03 E40.20 | E40.19 128.91,115.57 127.64,115.57 E40.17 | IC8.8 149.86,80.01 151.76,80.01 C9.2 | v91.44,80.01 103.5,80.01 C8.2 | v104.14,82.55 v114.3,82.55 118.75,82.55 119.38,83.19 v124.46,83.19 v127,83.19 v140.34,83.19 v149.22,83.19 | v127,128.27 165.1,128.27 GND3.1
I2C-SCL  (via drill 0.61)
  Top 0.381: SLOT2.27 264.16,95.89 262.89,97.16 262.89,111.12 264.16,112.39 SLOT1.27 | v345.44,39.37 345.44,60.96 342.9,63.5 342.9,88.27 335.28,95.89 v335.28,102.87 | v318.77,102.87 317.5,104.14 v317.5,107.31
  Bottom 0.381: v345.44,39.37 324.49,39.37 323.21,38.1 XESS.23 | v318.77,102.87 v335.28,102.87 | v317.5,107.31 314.96,109.86 304.8,109.86 297.81,116.84 266.06,116.84 265.43,116.2 265.43,113.67 264.16,113.67 SLOT1.27
I2C-SDA  (via drill 0.61)
  Top 0.381: 260.35,111.12 260.35,97.16 261.62,95.89 SLOT2.29 | 260.35,111.12 261.62,112.39 SLOT1.29 | v320.04,45.72 320.04,38.73 XESS.24 | v354.96,46.99 365.12,57.15 v365.12,125.09 | v262.25,135.89 260.35,133.99 260.35,111.12
  Bottom 0.381: v320.04,45.72 321.31,46.99 v354.96,46.99 | v365.12,125.09 354.33,135.89 v262.25,135.89
IDE-CS0#  (via drill 0.61)
  Top 0.381: v288.29,92.71 288.29,87 289.56,85.72 289.56,83.19 XESS.7 | v307.34,92.71 307.34,113.67 303.53,117.47 303.53,130.81 297.18,137.16 252.73,137.16 252.73,132.72 251.46,131.44 IDE.37
  Bottom 0.381: v288.29,92.71 v307.34,92.71
IDE-CS1#  (via drill 0.61)
  Top 0.381: v290.83,93.98 290.83,88.27 292.1,87 292.1,83.19 XESS.8 | v265.43,101.6 265.43,122.56 262.89,125.09 v262.89,128.91
  Bottom 0.381: v290.83,93.98 290.83,101.6 v265.43,101.6 | v262.89,128.91 262.25,129.54 253.37,129.54 252.73,130.18 252.73,132.72 251.46,132.72 IDE.38
IDE-DMACK#  (via drill 0.61)
  Top 0.381: v260.35,39.37 260.35,20.95 255.27,15.88 255.27,12.06 254,10.79 242.57,10.79 242.57,54.61 240.03,57.15 v240.03,128.27
  Bottom 0.381: v260.35,39.37 269.88,39.37 271.14,38.1 XESS.43 | v240.03,128.27 246.38,134.62 257.18,134.62 257.81,133.99 257.81,132.08 259.71,132.08 260.99,130.81 IDE.29
IDE-DMARQ  (via drill 0.61)
  Top 0.381: R12.1 314.96,99.69 314.96,100.97 R17.2 | v265.43,45.72 267.97,48.26 v267.97,55.88 | v297.18,58.42 v297.18,50.8 | v327.66,50.8 328.93,52.07 328.93,69.85 331.47,72.39 331.47,85.72 v330.2,87
  Bottom 0.381: v265.43,45.72 264.8,45.72 257.18,38.1 XESS.49 | v267.97,55.88 270.51,58.42 v297.18,58.42 | v297.18,50.8 v327.66,50.8 | v330.2,87 318.13,99.06 315.6,99.06 R12.1
IDE-IORDY  (via drill 0.61)
  Top 0.381: R15.1 314.96,92.08 316.23,93.34 316.23,94.61 317.5,95.89 R19.1 | v269.24,52.07 269.24,38.73 XESS.44 | v304.8,54.61 306.07,55.88 306.07,87 v307.34,88.27
  Bottom 0.381: v269.24,52.07 270.51,53.34 290.19,53.34 291.46,54.61 v304.8,54.61 | v307.34,88.27 310.51,91.44 314.32,91.44 R15.1
IDE-IRQ  (via drill 0.61)
  Top 0.381: R18.2 317.5,93.34 317.5,92.08 314.96,89.53 R16.1 314.96,88.27 v312.42,85.72
  Bottom 0.381: v312.42,85.72 301.62,85.72 299.72,83.82 281.31,83.82 280.04,82.55 XESS.3
IF0
  Top 0.381: R134.2 52.07,104.78 52.07,112.39 C40.24
IF1
  Top 0.381: R136.2 54.61,123.83 54.61,116.2 C40.25
IF2
  Top 0.381: R138.2 64.77,104.78 64.77,112.39 C40.34
ION
  Top 0.381: R62.2 350.52,123.83 349.25,122.56 349.25,114.94 350.52,113.67 D40.34
IOT
  Top 0.381: R55.2 333.38,124.46 334.64,125.73 336.55,125.73 336.55,117.47 337.82,116.2 D40.23
ISZ
  Top 0.381: R52.2 314.96,123.83 314.96,117.47 313.69,116.2 313.69,114.94 314.96,113.67 D40.6
JMP
  Top 0.381: R59.2 322.58,123.83 322.58,117.47 321.31,116.2 321.31,114.94 322.58,113.67 D40.12
JMS
  Top 0.381: R97.2 320.04,123.83 318.77,122.56 318.77,114.94 320.04,113.67 D40.10
LA
  Top 0.381: B40.18 119.38,8.26 118.11,9.53 118.11,18.41 119.38,19.68 R43.1 119.38,20.95 120.65,22.23 120.65,31.75 123.19,31.75 130.81,39.37 130.81,45.72 132.08,46.99 IC2.14
LCLK  (via drill 0.61)  (1 unrouted)
  Top 0.381: IC19.2 311.79,12.06 310.51,12.06 IC19.1 309.88,13.97 304.8,19.05 | 304.8,19.05 303.53,20.32 303.53,57.78 300.99,60.33 300.99,73.66 302.26,74.93 IC13.11 | 304.8,19.05 v304.17,18.41 | IC9.11 220.98,59.69 222.25,60.96 222.25,72.39 220.98,73.66 220.98,74.93 IC10.11 220.98,77.47 220.98,80.64 219.71,81.92 v219.71,102.87 | v243.21,100.97 243.21,93.98 245.11,92.08 245.11,81.92 246.38,80.64 246.38,77.47 IC12.11 | v270.51,8.26 v270.51,60.96 | v59.05,89.53 60.96,87.63 IC4.11 | IC5.11 119.38,67.31 120.65,68.58 120.65,83.82 119.38,85.09 IC6.11 | IC7.11 144.78,67.31 144.15,67.94 144.15,76.83 143.51,77.47 143.51,83.82 144.78,85.09 IC8.11 144.78,87.63 146.05,88.9 v146.05,105.41
  Bottom 0.381: IC17.16 287.65,19.68 288.93,18.41 290.19,18.41 291.46,19.68 IC17.14 292.74,19.68 294,18.41 v304.17,18.41 | IC13.11 302.89,75.56 305.44,73.03 327.02,73.03 329.56,75.56 IC16.11 | IC9.11 221.62,57.78 222.88,56.52 224.79,56.52 226.06,55.24 243.21,55.24 245.75,57.78 IC11.11 247.01,59.05 248.92,60.96 v270.51,60.96 | v243.21,100.97 241.3,102.87 v219.71,102.87 182.25,102.87 180.97,104.14 SV1.3 | v270.51,8.26 298.45,8.26 301.62,11.43 308.61,11.43 309.25,12.06 IC19.1 | v59.05,89.53 53.34,95.25 44.45,95.25 36.2,87 IC1.11 | v146.05,105.41 165.74,105.41 167,104.14 SV2.3 | IC8.11 144.15,85.72 142.88,84.45 121.28,84.45 120.02,85.72 IC6.11 118.75,85.72 116.84,83.82 63.5,83.82 61.59,85.72 IC4.11
LEFT  (via drill 0.61)  (1 unrouted)
  Top 0.381: v205.1,67.94 205.1,66.67 212.72,59.05 IC9.14 | v186.69,68.58 186.69,78.74 185.42,80.01 185.42,98.42 184.15,99.69 v184.15,106.68 | v165.1,87 166.37,88.27 166.37,104.78 167.64,106.05 SV2.1
  Bottom 0.381: v205.1,67.94 204.47,68.58 v186.69,68.58 | v184.15,106.68 180.97,106.68 SV1.1 | v165.1,87 150.5,87 IC8.9
LINK
  Top 0.381: R139.2 57.15,104.78 57.15,112.39 C40.28
LSER  (via drill 0.61)  (1 unrouted)
  Top 0.381: v281.94,15.88 281.94,19.05 IC17.18 | v320.68,15.88 323.85,19.05 v323.85,54.61 | v358.77,57.15 363.86,62.23 v363.86,128.27 | v187.32,133.35 184.15,130.18 184.15,112.39 179.07,107.31 179.07,98.42 180.34,97.16 SV1.9
  Bottom 0.381: v320.68,15.88 v281.94,15.88 | v323.85,54.61 326.39,57.15 v358.77,57.15 | v363.86,128.27 354.96,137.16 191.13,137.16 v187.32,133.35 | IC1.14 28.57,87 34.29,92.71 40.64,92.71 44.45,96.52 67.94,96.52 73.66,90.81 161.29,90.81 167,96.52 SV2.9
MA0
  Top 0.381: R99.2 109.22,123.83 109.22,116.2 E40.3
MA1
  Top 0.381: R104.2 114.3,104.78 114.3,112.39 E40.8
MA2
  Top 0.381: R109.2 121.92,123.83 121.92,116.2 E40.13
MA3
  Top 0.381: R114.2 132.08,104.78 132.08,112.39 E40.22
MA4
  Top 0.381: R119.2 139.7,123.83 139.7,116.2 E40.27
MA5
  Top 0.381: R124.2 144.78,104.78 144.78,112.39 E40.32
MA6
  Top 0.381: R68.2 198.12,123.83 198.12,116.2 F40.3
MA7
  Top 0.381: R73.2 203.2,104.78 203.2,112.39 F40.8
MA8
  Top 0.381: R78.2 210.82,123.83 210.82,116.2 F40.13
MA9
  Top 0.381: R83.2 220.98,104.78 220.98,112.39 F40.22
MA10
  Top 0.381: R88.2 228.6,123.83 228.6,116.2 F40.27
MA11
  Top 0.381: R93.2 233.68,104.78 233.68,112.39 F40.32
MASTER-RESET#  (via drill 0.61)
  Top 0.381: IDE.1 297.18,130.18 297.18,117.47 295.91,116.2 295.91,114.94 297.18,113.67 SLOT1.1 297.18,112.39 297.18,99.69 295.91,98.42 295.91,97.16 297.18,95.89 SLOT2.1 297.18,94.61 v297.18,91.44 | v285.75,36.83 285.75,10.79 283.85,10.79 282.57,12.06 IC17.3
  Bottom 0.381: v285.75,36.83 348.62,36.83 349.25,37.47 350.52,37.47 351.79,36.2 353.06,36.2 376.56,59.69 376.56,84.45 343.54,84.45 341,81.92 337.19,81.92 333.38,85.72 325.75,85.72 318.77,92.71 309.25,92.71 306.7,90.17 299.08,90.17 297.81,91.44 v297.18,91.44
MB0
  Top 0.381: R100.2 111.76,123.83 111.76,116.2 E40.5
MB1
  Top 0.381: R105.2 111.76,104.78 111.76,112.39 E40.6
MB2
  Top 0.381: R110.2 124.46,123.83 124.46,116.2 E40.15
MB3
  Top 0.381: R115.2 124.46,104.78 124.46,112.39 E40.16
MB4
  Top 0.381: R120.2 142.24,123.83 142.24,116.2 E40.29
MB5
  Top 0.381: R125.2 142.24,104.78 142.24,112.39 E40.30
MB6
  Top 0.381: R69.2 200.66,123.83 200.66,116.2 F40.5
MB7
  Top 0.381: R74.2 200.66,104.78 200.66,112.39 F40.6
MB8
  Top 0.381: R79.2 213.36,123.83 213.36,116.2 F40.15
MB9
  Top 0.381: R84.2 213.36,104.78 213.36,112.39 F40.16
MB10
  Top 0.381: R89.2 231.14,123.83 231.14,116.2 F40.29
MB11
  Top 0.381: R94.2 231.14,104.78 231.14,112.39 F40.30
MQ0
  Top 0.381: R102.2 116.84,123.83 116.84,116.2 E40.9
MQ1
  Top 0.381: R107.2 106.68,104.78 106.68,112.39 E40.2
MQ2
  Top 0.381: R112.2 134.62,123.83 134.62,116.2 E40.23
MQ3
  Top 0.381: R117.2 119.38,104.78 119.38,112.39 E40.12
MQ4
  Top 0.381: R122.2 147.32,123.83 147.32,116.2 E40.33
MQ5
  Top 0.381: R127.2 137.16,104.78 137.16,112.39 E40.26
MQ6
  Top 0.381: R71.2 205.74,123.83 205.74,116.2 F40.9
MQ7
  Top 0.381: R76.2 195.58,104.78 195.58,112.39 F40.2
MQ8
  Top 0.381: R81.2 223.52,123.83 223.52,116.2 F40.23
MQ9
  Top 0.381: R86.2 208.28,104.78 208.28,112.39 F40.12
MQ10
  Top 0.381: R91.2 236.22,123.83 236.22,116.2 F40.33
MQ11
  Top 0.381: R96.2 226.06,104.78 226.06,112.39 F40.26
N$1
  Bottom 0.381: IC14.9 48.9,48.9 50.16,50.16 73.03,50.16 74.3,48.9 IC15.10
N$2
  Bottom 0.381: IC15.9 78.11,47.62 80.01,45.72 139.7,45.72 141.6,47.62 IC2.10
N$3
  Bottom 0.381: IC18.10 114.94,48.9 116.2,50.16 142.88,50.16 144.15,48.9 IC2.9
N$4  (via drill 0.61)
  Top 0.381: v113.03,64.14 113.03,80.01 111.76,81.28 111.76,85.09 IC6.14
  Bottom 0.381: v113.03,64.14 115.57,64.14 115.57,67.31 116.2,67.94 122.56,67.94 123.83,66.67 IC5.9
N$5
  Top 0.381: IC3.10 241.3,21.59 241.3,27.3 R3.2
N$6
  Top 0.381: IC3.11 238.76,21.59 238.76,24.77 R1.2
N$7  (via drill 0.61)
  Top 0.381: v298.45,47.62 298.45,37.47 302.26,33.66 302.26,17.14 311.79,7.62 314.32,7.62 R2.2 | v248.92,48.26 245.11,44.45 245.11,22.86 243.84,21.59 IC3.9
  Bottom 0.381: v298.45,47.62 297.81,48.26 v248.92,48.26
N$8
  Top 0.381: C1.2 228.6,8.26 228.6,11.43 IC3.2
N$9
  Top 0.381: C2.2 231.14,5.71 231.14,11.43 IC3.3
N$10
  Bottom 0.381: IC1.9 41.27,87 42.55,88.27 51.44,88.27 52.7,87 IC4.14
N$11
  Top 0.381: C2.1 226.06,5.71 226.06,11.43 IC3.1
N$12
  Top 0.381: C4.1 241.3,5.71 240.03,6.99 240.03,10.16 238.76,11.43 IC3.6
N$13  (via drill 0.61)
  Top 0.381: v150.5,71.12 150.5,67.94 149.86,67.31 IC7.9 | v139.06,72.39 138.43,73.03 138.43,80.01 137.16,81.28 137.16,85.09 IC8.14
  Bottom 0.381: v150.5,71.12 149.22,72.39 v139.06,72.39
N$14  (via drill 0.61)
  Top 0.381: v137.16,71.12 125.73,82.55 125.73,83.82 124.46,85.09 IC6.9
  Bottom 0.381: v137.16,71.12 137.16,67.31 IC7.14
N$15  (via drill 0.61)
  Top 0.381: v238.76,71.75 238.76,74.93 IC12.14 | v251.46,71.75 252.73,70.48 252.73,60.96 251.46,59.69 IC11.9
  Bottom 0.381: v251.46,71.75 v238.76,71.75
N$16  (via drill 0.61)
  Top 0.381: v228.6,62.87 v228.6,75.56
  Bottom 0.381: v228.6,62.87 234.31,62.87 238.12,59.05 IC11.14 | v228.6,75.56 226.69,75.56 IC10.9
N$17
  Bottom 0.381: IC13.9 307.98,75.56 309.25,74.3 320.68,74.3 321.94,75.56 IC16.14
N$18
  Top 0.381: C3.1 233.68,8.26 233.68,11.43 IC3.4
N$19
  Top 0.381: IC9.9 225.43,57.78 224.16,56.52 217.17,56.52 217.17,59.69 214.63,62.23 214.63,72.39 213.36,73.66 213.36,74.93 IC10.14
N$20
  Top 0.381: C3.2 238.76,8.26 236.22,10.79 236.22,11.43 IC3.5
N$21  (via drill 0.61)
  Top 0.381: v76.2,74.93 66.04,85.09 IC4.9 | v107.31,74.93 111.76,70.48 111.76,67.31 IC5.14
  Bottom 0.381: v76.2,74.93 v107.31,74.93
N$22
  Top 0.381: IC19.5 320.68,12.06 323.21,9.53 331.47,9.53 331.47,64.77 334.01,67.31 334.01,69.85 335.28,71.12 335.28,74.93 IC16.9
N$23  (via drill 0.61)
  Top 0.381: v254.63,71.75 251.46,74.93 IC12.9 | v294.64,71.75 294.64,74.93 IC13.14
  Bottom 0.381: v254.63,71.75 v294.64,71.75
N$24  (via drill 0.61)
  Top 0.381: v295.91,78.11 v295.91,85.09 | v322.58,87 v322.58,111.12 | v321.31,118.11 v321.31,133.35
  Bottom 0.381: v295.91,78.11 294,78.11 292.74,76.83 IC13.15 | v295.91,85.09 297.81,87 v322.58,87 | v322.58,111.12 321.31,112.39 v321.31,118.11 | v321.31,133.35 319.4,133.35 318.13,134.62 R51.1
N$25  (via drill 0.61)
  Top 0.381: v287.02,62.23 v287.02,66.04 | v337.82,60.96 339.09,62.23 339.09,90.81 334.01,95.89 v334.01,111.12 | v316.23,123.19 316.23,132.72 314.96,133.99 R52.1
  Bottom 0.381: v287.02,66.04 288.93,67.94 IC13.1 | v287.02,62.23 288.29,60.96 v337.82,60.96 | v334.01,111.12 333.38,111.76 327.02,111.76 326.39,112.39 326.39,118.75 325.75,118.75 321.31,123.19 v316.23,123.19
N$26  (via drill 0.61)
  Top 0.381: v314.96,65.41 314.96,80.64 316.23,81.92 316.23,83.82 320.04,87.63 v320.04,111.12 | v313.69,118.11 313.69,132.72 312.42,133.99 R53.1
  Bottom 0.381: v314.96,65.41 295.27,65.41 292.74,67.94 IC13.2 | v320.04,111.12 318.77,112.39 318.77,118.11 v313.69,118.11
N$27
  Bottom 0.381: IC19.3 315.6,12.06 316.87,12.06 IC19.4
N$28
  Top 0.381: R11.1 292.1,5.71 292.1,11.43 IC17.7
N$29  (via drill 0.61)
  Top 0.381: v261.62,109.86 261.62,106.05 R21.2
  Bottom 0.381: v261.62,109.86 259.08,112.39 SLOT1.31
N$30
  Top 0.381: R22.2 259.08,104.78 259.08,99.69 257.81,98.42 257.81,97.16 259.08,95.89 SLOT2.31
N$31  (via drill 0.61)
  Top 0.381: C5.1 264.16,17.14 264.16,16.51 EXTRESET.2 263.52,13.97 263.52,3.81 EXTRESET.1 | R20.2 266.06,17.78 264.8,17.78 C5.1 | v264.16,26.04 264.16,18.41 C5.1 | v284.48,26.04 284.48,21.59 IC17.17
  Bottom 0.381: 269.88,26.67 269.24,26.04 v264.16,26.04 | 269.88,26.67 271.14,27.94 R23.2 | v284.48,26.04 283.85,26.67 269.88,26.67
N$32  (via drill 0.61)
  Top 0.381: v316.23,66.67 316.23,79.38 318.77,81.92 318.77,85.09 321.31,87.63 v321.31,107.31 | v311.15,118.11 311.15,132.72 309.88,133.99 R54.1
  Bottom 0.381: v316.23,66.67 296.55,66.67 295.27,67.94 IC13.3 | v321.31,107.31 316.23,112.39 316.23,116.84 312.42,116.84 v311.15,118.11
N$33  (via drill 0.61)
  Top 0.381: v298.45,58.42 298.45,66.04 297.18,67.31 IC13.4 | v358.14,58.42 362.58,62.87 362.58,125.73 351.15,137.16 332.74,137.16 332.74,135.25 R55.1
  Bottom 0.381: v298.45,58.42 v358.14,58.42
N$34  (via drill 0.61)
  Top 0.381: v302.26,93.98 302.26,90.81 303.53,89.53 303.53,81.92 300.99,79.38 300.99,74.93 299.72,73.66 299.72,69.85 IC13.5 | v309.88,102.87 308.61,104.14 308.61,113.67 307.34,114.94 307.34,133.99 309.25,135.89 330.2,135.89 330.2,135.25 R56.1
  Bottom 0.381: v302.26,93.98 303.53,95.25 308.61,95.25 309.88,96.52 v309.88,102.87
N$35  (via drill 0.61)
  Top 0.381: v303.53,59.69 303.53,66.04 302.26,67.31 IC13.6 | v346.71,59.69 353.06,66.04 v353.06,123.83 | v327.66,130.81 327.66,133.99 R57.1
  Bottom 0.381: v303.53,59.69 v346.71,59.69 | v353.06,123.83 346.07,130.81 v327.66,130.81
N$36  (via drill 0.61)
  Top 0.381: v304.8,64.14 304.8,67.31 IC13.7 | v344.17,64.14 344.17,92.08 342.9,93.34 342.9,108.58 339.09,112.39 v339.09,125.73 | v325.75,129.54 325.12,130.18 325.12,133.99 R58.1
  Bottom 0.381: v304.8,64.14 v344.17,64.14 | v339.09,125.73 335.28,129.54 v325.75,129.54
N$37
  Top 0.381: IC16.15 320.04,77.47 321.31,78.74 321.31,83.82 323.85,86.36 323.85,132.72 322.58,133.99 R59.1
N$38  (via drill 0.61)
  Top 0.381: v355.6,73.66 358.14,76.2 358.14,122.56 346.07,134.62 R60.1
  Bottom 0.381: v355.6,73.66 334.01,73.66 330.83,70.48 319.4,70.48 318.13,69.22 IC16.1
N$39  (via drill 0.61)
  Top 0.381: v359.41,65.41 360.05,66.04 360.05,121.92 347.98,133.99 R61.1
  Bottom 0.381: v359.41,65.41 323.21,65.41 320.68,67.94 IC16.2
N$40  (via drill 0.61)
  Top 0.381: v361.31,66.67 361.31,125.73 352.43,134.62 351.15,134.62 R62.1
  Bottom 0.381: v361.31,66.67 324.49,66.67 323.21,67.94 IC16.3
N$41  (via drill 0.61)
  Top 0.381: v326.39,107.31 326.39,87.63 323.85,85.09 323.85,71.12 325.12,69.85 IC16.4 | v346.71,127 342.9,130.81 342.9,133.99 R63.1
  Bottom 0.381: v326.39,107.31 328.3,109.22 343.54,109.22 346.71,112.39 v346.71,127
N$42  (via drill 0.61)
  Top 0.381: v328.93,95.25 328.93,71.12 327.66,69.85 IC16.5 | v349.25,101.6 350.52,102.87 350.52,111.12 351.79,112.39 351.79,125.09 346.07,130.81 344.17,130.81 344.17,135.25 343.54,135.89 340.36,135.89 340.36,135.25 R64.1
  Bottom 0.381: v328.93,95.25 335.28,101.6 v349.25,101.6
N$43  (via drill 0.61)
  Top 0.381: v346.71,72.39 347.98,73.66 347.98,106.05 341.63,112.39 341.63,130.18 337.82,133.99 R65.1
  Bottom 0.381: v346.71,72.39 334.01,72.39 330.83,69.22 IC16.6
N$44
  Top 0.381: IC16.7 332.74,69.85 334.01,71.12 334.01,85.09 331.47,87.63 331.47,130.18 335.28,133.99 R66.1
N$45  (via drill 0.61)
  Top 0.381: v196.22,81.92 196.22,92.71 196.85,93.34 196.85,132.72 195.58,133.99 R67.1
  Bottom 0.381: v196.22,81.92 176.53,81.92 176.53,74.93 188.59,62.87 193.04,62.87 195.58,60.33 208.91,60.33 210.19,59.05 IC9.15
N$46  (via drill 0.61)
  Top 0.381: v191.13,50.8 189.23,52.7 v189.23,133.35
  Bottom 0.381: v191.13,50.8 207.65,50.8 IC9.1 | v189.23,133.35 196.22,133.35 197.49,134.62 R68.1